# EAGLE design sidInterface (EAGLE 5.11)
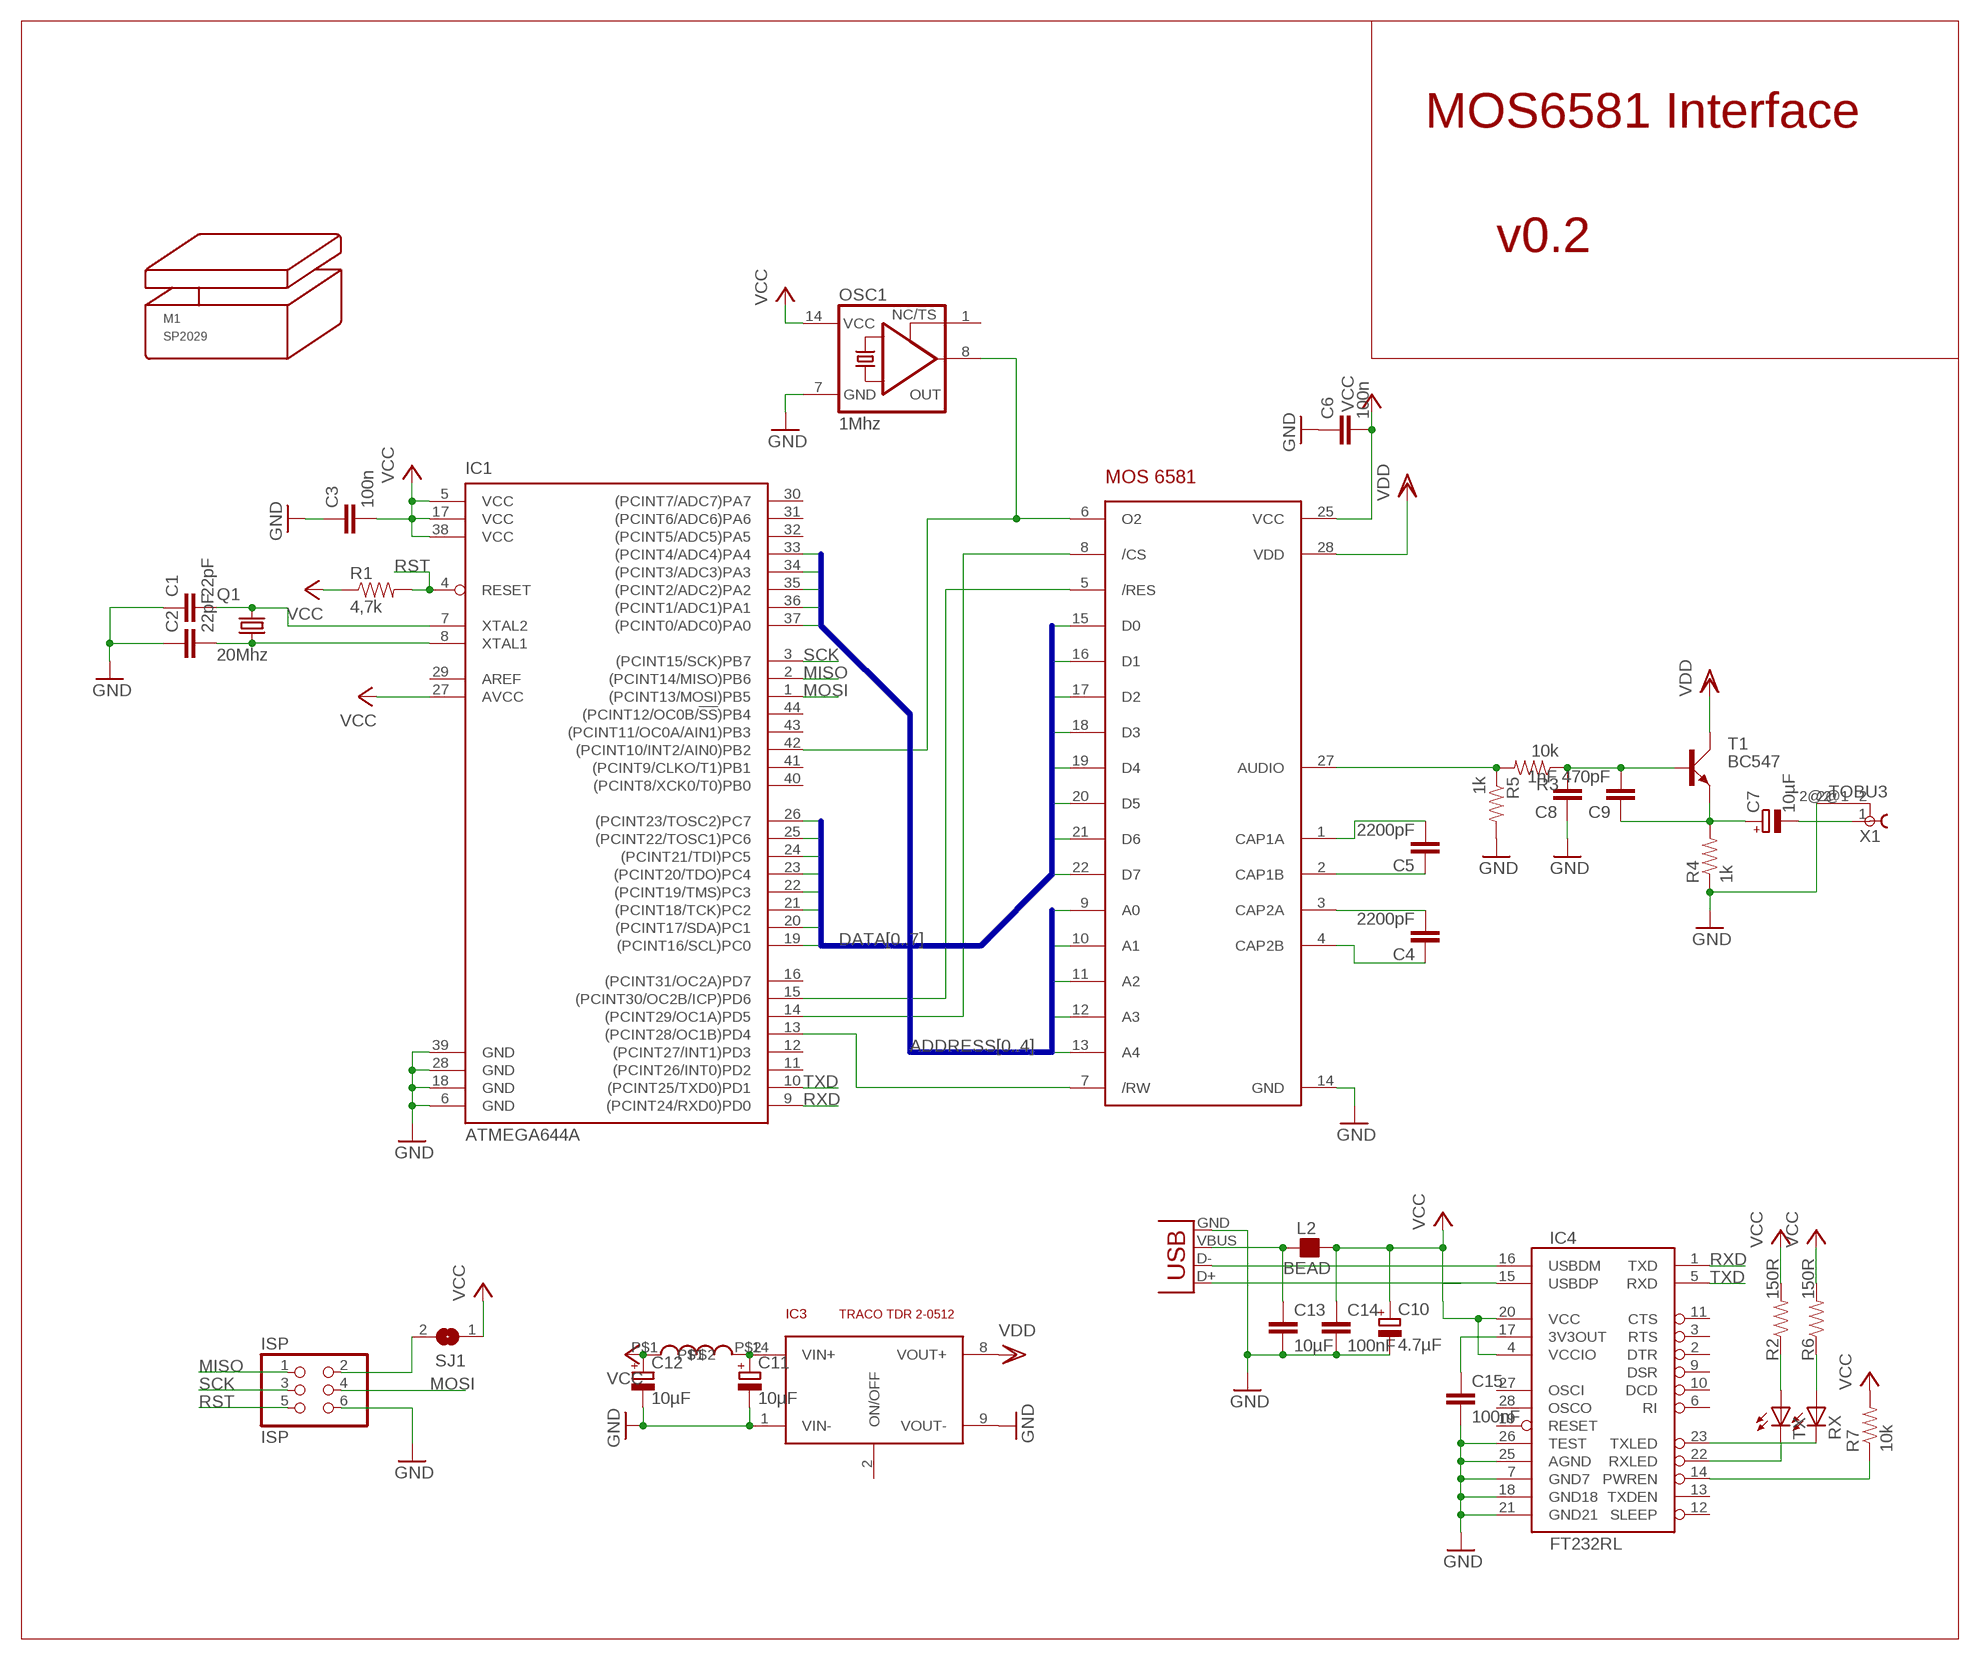
[diagram p0: schematic, sheet 1]

## Parts
C1  22pF  CAP0805  [0805]
C2  22pF  CAP0805  [0805]
C3  100n  CAP0805  [0805]
C4  2200pF  CAP0805  [0805]
C5  2200pF  CAP0805  [0805]
C6  100n  CAP0805  [0805]
C7  10µF  CPOL-EUSMCC  [SMC_C]
C8  1nF  CAP0805  [0805]
C9  470pF  CAP0805  [0805]
C10  4.7µF  CPOL-EUSMCC  [SMC_C]
C11  10µF  CPOL-EUSMCC  [SMC_C]
C12  10µF  CPOL-EUSMCC  [SMC_C]
C13  10µF  CAP0805  [0805]
C14  100nF  CAP0805  [0805]
C15  100nF  CAP0805  [0805]
IC1  ATMEGA644A  [TQFP44]
IC2  MOS6581  [DIL28]
IC3  TRACO TDR 2-0512  TRACO_TDR_2  [TRACO_TDR_2]
IC4  FT232RL  FT232RLSSOP  [SSOP28DB]
ISP  ISP  PINHD-2X03_2.54  [2X03]
L1  SMD-INDUCTOR-4012  [SMD4012]
L2  BEAD  FB_0805  [L0805]
M1  SP2029  [SP2029]
OSC1  1Mhz  XO-14  [DIL14S]
Q1  20Mhz  X22-OSCILLATOR  [X22]
R1  4,7k  RESISTOR  [0805]
R2  150R  RESISTOR  [0805]
R3  10k  RESISTOR  [0805]
R4  1k  RESISTOR  [0805]
R5  1k  RESISTOR  [0805]
R6  150R  RESISTOR  [0805]
R7  10k  RESISTOR  [0805]
RX  LEDCHIP-LED0805  [CHIP-LED0805]
SJ1  SJ  [SJ]
T1  BC547  [SOT54A]
TX  LEDCHIP-LED0805  [CHIP-LED0805]
X1  TOBU3  [TOBU3]
X2  USB-SMD-NS  [USB-MINIB-NOSTOP]

## Nets
ADDRESS0: IC1.37((PCINT0/ADC0)PA0) IC2.9(A0)
ADDRESS1: IC1.36((PCINT1/ADC1)PA1) IC2.10(A1)
ADDRESS2: IC1.35((PCINT2/ADC2)PA2) IC2.11(A2)
ADDRESS3: IC1.34((PCINT3/ADC3)PA3) IC2.12(A3)
ADDRESS4: IC1.33((PCINT4/ADC4)PA4) IC2.13(A4)
DATA0: IC1.19((PCINT16/SCL)PC0) IC2.15(D0)
DATA1: IC1.20((PCINT17/SDA)PC1) IC2.16(D1)
DATA2: IC1.21((PCINT18/TCK)PC2) IC2.17(D2)
DATA3: IC1.22((PCINT19/TMS)PC3) IC2.18(D3)
DATA4: IC1.23((PCINT20/TDO)PC4) IC2.19(D4)
DATA5: IC1.24((PCINT21/TDI)PC5) IC2.20(D5)
DATA6: IC1.25((PCINT22/TOSC1)PC6) IC2.21(D6)
DATA7: IC1.26((PCINT23/TOSC2)PC7) IC2.22(D7)
GND: C1.1 C2.1 C3.1 C6.1 C8.1 C10.- C11.- C12.- C13.2 C14.2 C15.2 IC1.6(GND) IC1.18(GND) IC1.28(GND) IC1.39(GND) IC2.14(GND) IC3.1(VIN-) IC3.9(VOUT-) IC4.7(GND7) IC4.18(GND18) IC4.21(GND21) IC4.25(AGND) IC4.26(TEST) ISP.6 OSC1.7(GND) R4.1 R5.2 X1.2@2 X2.GND
MISO: IC1.2((PCINT14/MISO)PB6) ISP.1
MOSI: IC1.1((PCINT13/MOSI)PB5) ISP.4
N$1: C2.2 IC1.8(XTAL1) Q1.1
N$2: C1.2 IC1.7(XTAL2) Q1.3
N$3: ISP.2 SJ1.2
N$4: C4.2 IC2.3(CAP2A)
N$5: C5.1 IC2.2(CAP1B)
N$6: C4.1 IC2.4(CAP2B)
N$7: C5.2 IC2.1(CAP1A)
N$8: IC1.13((PCINT28/OC1B)PD4) IC2.7(/RW)
N$9: IC1.15((PCINT30/OC2B/ICP)PD6) IC2.5(/RES)
N$10: IC1.14((PCINT29/OC1A)PD5) IC2.8(/CS)
N$11: IC1.42((PCINT10/INT2/AIN0)PB2) IC2.6(O2) OSC1.8(OUT)
N$14: IC2.27(AUDIO) R3.2 R5.1
N$15: C11.+ IC3.14(VIN+) L1.P$2
N$16: C8.2 C9.2 R3.1 T1.B
N$17: C7.+ C9.1 R4.2 T1.E
N$18: IC4.16(USBDM) X2.D-
N$19: C7.- X1.1
N$20: IC4.15(USBDP) X2.D+
N$21: R2.1 TX.A
N$22: R6.1 RX.A
N$23: C13.1 L2.1 X2.VBUS
N$24: IC4.14(PWREN) R7.1
N$27: IC4.22(RXLED) TX.C
N$28: IC4.23(TXLED) RX.C
N$29: C15.1 IC4.17(3V3OUT)
RST: IC1.4(RESET) ISP.5 R1.2
RXD: IC1.9((PCINT24/RXD0)PD0) IC4.1(TXD)
SCK: IC1.3((PCINT15/SCK)PB7) ISP.3
TXD: IC1.10((PCINT25/TXD0)PD1) IC4.5(RXD)
VCC: C3.2 C6.2 C10.+ C12.+ C14.1 IC1.5(VCC) IC1.17(VCC) IC1.27(AVCC) IC1.38(VCC) IC2.25(VCC) IC4.4(VCCIO) IC4.20(VCC) L1.P$1 L2.2 OSC1.14(VCC) R1.1 R2.2 R6.2 R7.2 SJ1.1
VDD: IC2.28(VDD) IC3.8(VOUT+) T1.C
Unconnected: IC1.11((PCINT26/INT0)PD2) IC1.12((PCINT27/INT1)PD3) IC1.16((PCINT31/OC2A)PD7) IC1.29(AREF) IC1.30((PCINT7/ADC7)PA7) IC1.31((PCINT6/ADC6)PA6) IC1.32((PCINT5/ADC5)PA5) IC1.40((PCINT8/XCK0/T0)PB0) IC1.41((PCINT9/CLKO/T1)PB1) IC1.43((PCINT11/OC0A/AIN1)PB3) IC1.44((PCINT12/OC0B/!SS!)PB4) IC3.2(ON/OFF) IC4.2(DTR) IC4.3(RTS) IC4.6(RI) IC4.9(DSR) IC4.10(DCD) IC4.11(CTS) IC4.12(SLEEP) IC4.13(TXDEN) IC4.19(RESET) IC4.27(OSCI) IC4.28(OSCO) OSC1.1(TS) X1.2 X1.2@1

## Buses
DATA[0..7]
ADDRESS[0..4]

## Notes on the sheet
- MOS6581 Interface
- v0.2
- TRACO TDR 2-0512

## Library data of the parts
C1-C6 C8 C9 C13-C15 = SparkFun:CAP: Capacitor Standard 0603 ceramic capacitor, and 0.1" leaded capacitor.
C7 C10-C12 = resistor:CPOL-EU: POLARIZED CAPACITOR, European symbol
IC1 = atmel:ATMEGA644: 8-bit Microcontroller with 64K Bytes In-System Programmable Flash Source: http://www.atmel.com/dyn/resources/prod_documents/doc2593.pdf; MPN: ATMEGA644PV-10AU; OC_FARNELL: 1455123; OC_NEWARK: 58M3748
IC2 = seb:MOS6581
IC3 = seb:TRACO_TDR_2
IC4 = SparkFun:FT232RL: USB UART FT232RL 4th Generation USB UART (USB <-> Serial) Controller. Spark Fun Electronics SKU : COM-00650
ISP = pinhead-2:PINHD-2X03: PIN HEADER
L1 = seb:SMD-INDUCTOR-4012
L2 = rc-master-smd:FB_: FERRITE BEAD
M1 = strapubox:SP2029: Gehäuse Strapubox Typ 2029 max. Bauteilhöhe, top-layer: 11,5 mm max. Bauteilhöhe, bottom-layer: 3,5 mm (Dicke der LP: 1,5 mm) Außenmaße: Länge: 80 mm Breite: 61 mm Höhe: 20,5 mm
OSC1 = crystal:XO-: CRYSTAL; OC_FARNELL: unknown; OC_NEWARK: unknown
Q1 = seb:X22-OSCILLATOR
R1-R7 = SparkFun:RESISTOR: Resistor Basic schematic elements and footprints for 0603, 1206, and PTH 1/10th watt (small) resistors.
RX TX = led:LED: LED OSRAM: - CHIPLED LG R971, LG N971, LY N971, LG Q971, LY Q971, LO R971, LY R971 LH N974, LH R974 LS Q976, LO Q976, LY Q976 LO Q996 - Hyper CHIPLED LW Q18S LB Q993, LB Q99A, LB R99A - SideLED LS A670, LO A670, LY A670, LG A670, LP A670 LB A673, LV A673, LT A673, LW A673 LH A674 LY A675 LS A676, LA A676, LO A676, LY A676, LW A676 LS A679, LY A679, LG A679 - Hyper Micro SIDELED® LS Y876, LA Y876, LO Y876, LY Y876 LT Y87S - SmartLED LW L88C, LW L88S LB L89C, LB L89S, LG L890 LS L89K, LO L89K, LY L89K LS L896, LA L896, LO L896, LY L896 - TOPLED LS T670, LO T670, LY T670, LG T670, LP T670 LSG T670, LSP T670, LSY T670, LOP T670, LYG T670 LG T671, LOG T671, LSG T671 LB T673, LV T673, LT T673, LW T673 LH T674 LS T676, LA T676, LO T676, LY T676, LB T676, LH T676, LSB T676, LW T676 LB T67C, LV T67C, LT T67C, LS T67K, LO T67K, LY T67K, LW E67C LS E67B, LA E67B, LO E67B, LY E67B, LB E67C, LV E67C, LT E67C LW T67C LS T679, LY T679, LG T679 LS T770, LO T770, LY T770, LG T770, LP T770 LB T773, LV T773, LT T773, LW T773 LH T774 LS E675, LA E675, LY E675, LS T675 LS T776, LA T776, LO T776, LY T776, LB T776 LHGB T686 LT T68C, LB T68C - Hyper Mini TOPLED® LB M676 - Mini TOPLED Santana® LG M470 LS M47K, LO M47K, LY M47K Source: http://www.osram.convergy.de LUXEON: - LUMILED® LXK2-PW12-R00, LXK2-PW12-S00, LXK2-PW14-U00, LXK2-PW14-V00 LXK2-PM12-R00, LXK2-PM12-S00, LXK2-PM14-U00 LXK2-PE12-Q00, LXK2-PE12-R00, LXK2-PE12-S00, LXK2-PE14-T00, LXK2-PE14-U00 LXK2-PB12-K00, LXK2-PB12-L00, LXK2-PB12-M00, LXK2-PB14-N00, LXK2-PB14-P00, LXK2-PB14-Q00 LXK2-PR12-L00, LXK2-PR12-M00, LXK2-PR14-Q00, LXK2-PR14-R00 LXK2-PD12-Q00, LXK2-PD12-R00, LXK2-PD12-S00 LXK2-PH12-R00, LXK2-PH12-S00 LXK2-PL12-P00, LXK2-PL12-Q00, LXK2-PL12-R00 Source: www.luxeon.com KINGBRIGHT: KA-3528ASYC Source: www.kingbright.com
SJ1 = jumper:SJ: SMD solder JUMPER
T1 = transistor-small-signal:BC547: NPN TRANSISTOR
X1 = con-hirschmann:TOBU3: Female Cinch CONNECTOR ( RCA Jack ); MF: FARNELL; MPN: TOBU 3; OC_FARNELL: 592791; OC_NEWARK: 06WX5914
X2 = SparkFun:USB: USB Connectors USB-B-PTH is fully proven SKU : PRT-00139 USB-miniB is fully proven SKU : PRT-00587 USB-A-PCB is untested. USB-A-H is throughly reviewed, but untested. Spark Fun Electronics SKU : PRT-00437 USB-B-SMT is throughly reviewed, but untested. Needs silkscreen touching up. USB-A-S has not been used/tested USB-MB-H has not been used/tested

## Board
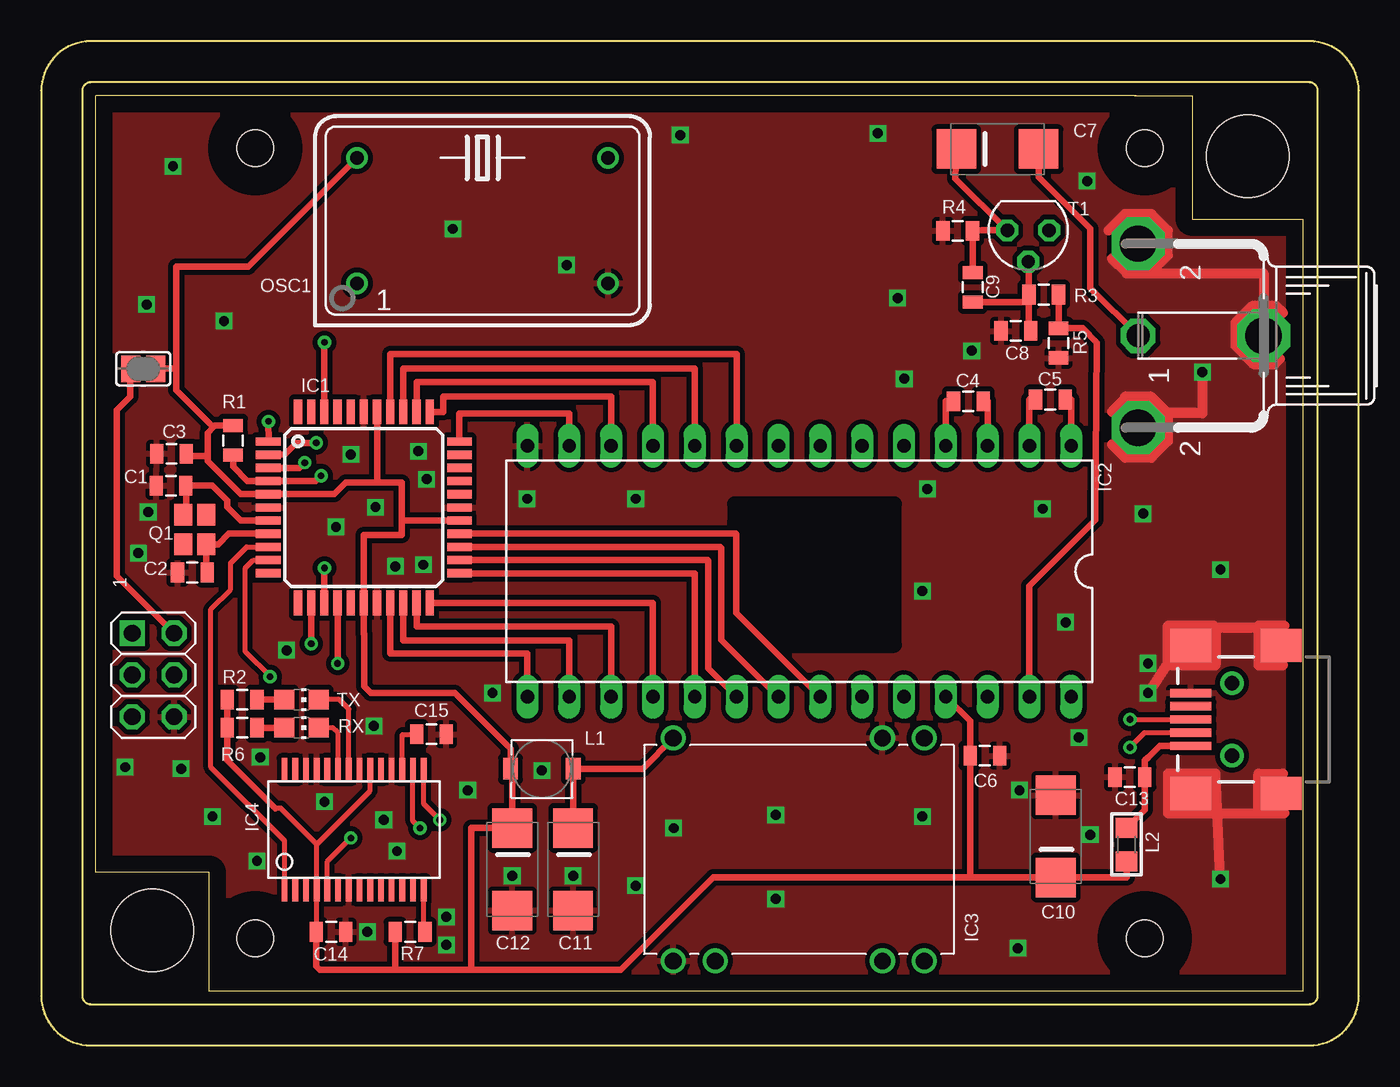
[diagram p1: board, top side]
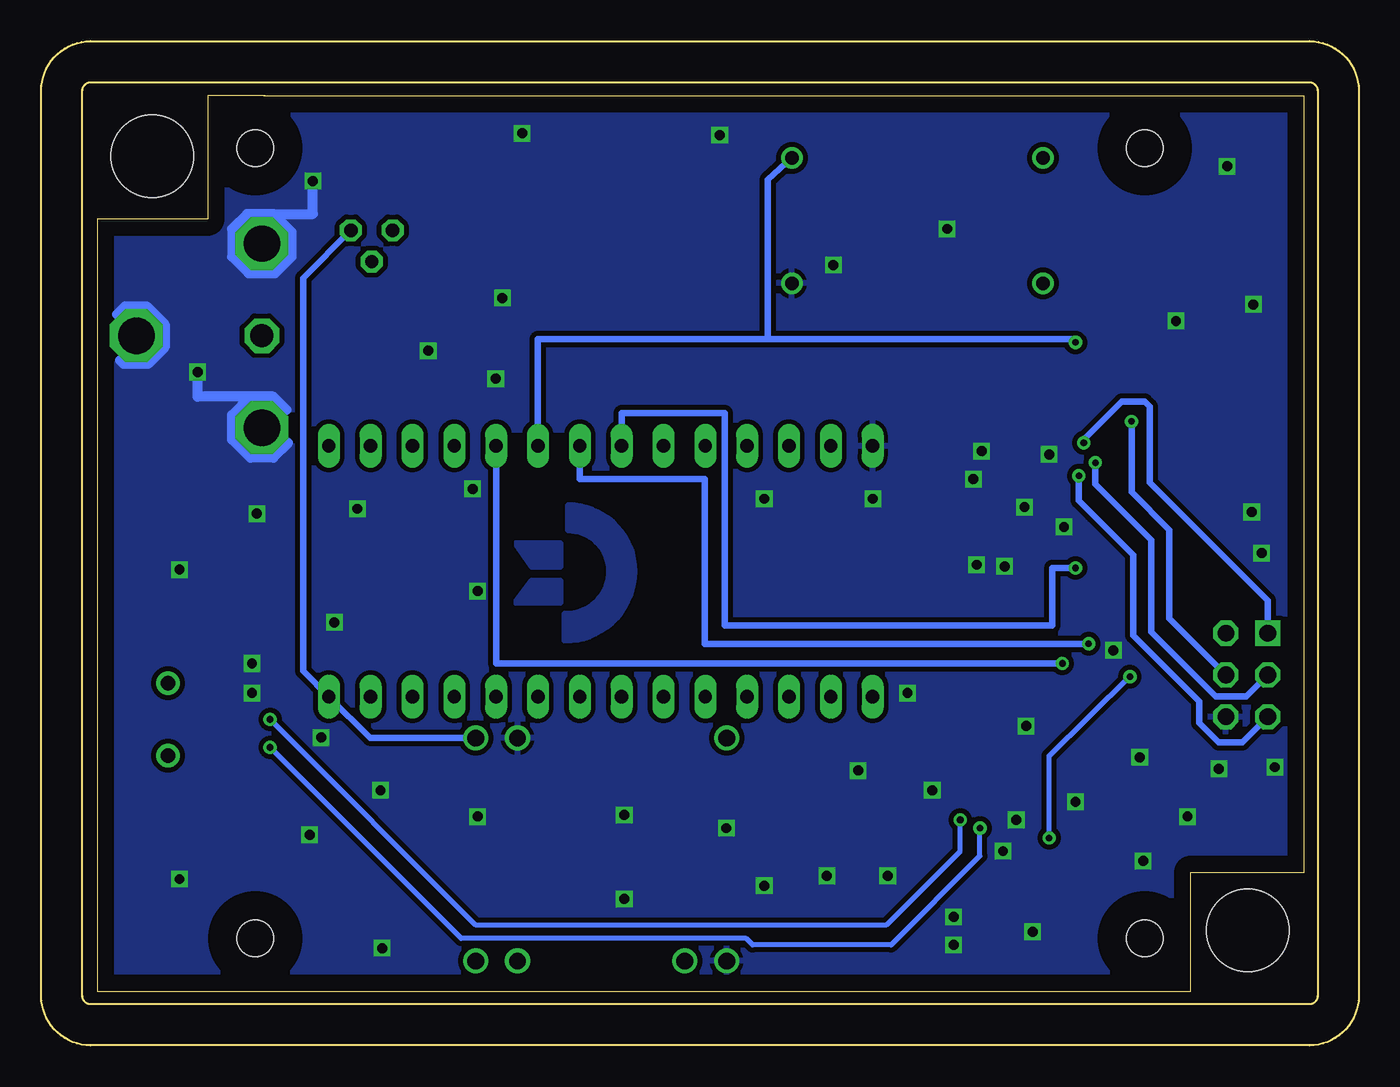
[diagram p2: board, bottom side, seen from below]

Size 73.3 x 54.4 mm. Coordinates in mm from the lower left corner, seen from the top.
Outline: 63.2,54.4 63.1,54.4
Outline: 63.1,54.4 0,54.4 0,7.2 6.9,7.2 6.9,0 73.3,0 73.3,46.9 66.6,46.9 66.6,54.4 63.1,54.4
Copper layers (1*16): Top 0.035mm / dielectric 1.5mm / Bottom 0.035mm
Design rules "default *": minimum track width 10mil, minimum drill 0.4mm, track to track 8mil, track to pad 8mil, pad to pad 8mil, via to via 8mil, smd to smd 8mil, copper to edge 40mil, drill to drill 8mil, minimum pad ring 10mil, minimum via ring 8mil, stop-mask expansion 4mil, vias tented up to drill 24mil, thermal gap 10mil
tRestrict: 5 lines
bRestrict: 2 lines

### Footprints (pad centres in the part's own frame; a part is rotated, then mirrored left to right if it is on the bottom)
0805 = smd 0.8 x 1.2: 1 -0.9,0; 2 0.9,0
SMC_C = smd 2.4 x 2.4: + -2.5,0; - 2.5,0
TQFP44 = smd 1.5 x 0.5: 1 -5.8,4; 2 -5.8,3.2; 3 -5.8,2.4; 4 -5.8,1.6; 5 -5.8,0.8; 6 -5.8,0; 7 -5.8,-0.8; 8 -5.8,-1.6; 9 -5.8,-2.4; 10 -5.8,-3.2; 11 -5.8,-4; 23 5.8,-4; 24 5.8,-3.2; 25 5.8,-2.4; 26 5.8,-1.6; 27 5.8,-0.8; 28 5.8,0; 29 5.8,0.8; 30 5.8,1.6; 31 5.8,2.4; 32 5.8,3.2; 33 5.8,4 | smd 0.5 x 1.5: 12 -4,-5.8; 13 -3.2,-5.8; 14 -2.4,-5.8; 15 -1.6,-5.8; 16 -0.8,-5.8; 17 0,-5.8; 18 0.8,-5.8; 19 1.6,-5.8; 20 2.4,-5.8; 21 3.2,-5.8; 22 4,-5.8; 34 4,5.8; 35 3.2,5.8; 36 2.4,5.8; 37 1.6,5.8; 38 0.8,5.8; 39 0,5.8; 40 -0.8,5.8; 41 -1.6,5.8; 42 -2.4,5.8; 43 -3.2,5.8; 44 -4,5.8
DIL28 = drill 0.813 long: 1 -16.51,-7.62; 2 -13.97,-7.62; 3 -11.43,-7.62; 4 -8.89,-7.62; 5 -6.35,-7.62; 6 -3.81,-7.62; 7 -1.27,-7.62; 8 1.27,-7.62; 9 3.81,-7.62; 10 6.35,-7.62; 11 8.89,-7.62; 12 11.43,-7.62; 13 13.97,-7.62; 14 16.51,-7.62; 15 16.51,7.62; 16 13.97,7.62; 17 11.43,7.62; 18 8.89,7.62; 19 6.35,7.62; 20 3.81,7.62; 21 1.27,7.62; 22 -1.27,7.62; 23 -3.81,7.62; 24 -6.35,7.62; 25 -8.89,7.62; 26 -11.43,7.62; 27 -13.97,7.62; 28 -16.51,7.62
TRACO_TDR_2 = drill 1.016 round: 1 6.769,-7.62; 2 6.769,-5.08; 6 6.769,5.08; 7 6.769,7.62; 8 -6.769,7.62; 9 -6.769,5.08; 14 -6.769,-7.62
SSOP28DB = smd 0.348 x 1.397: 1 -4.225,-3.656; 2 -3.575,-3.656; 3 -2.925,-3.656; 4 -2.275,-3.656; 5 -1.625,-3.656; 6 -0.975,-3.656; 7 -0.325,-3.656; 8 0.325,-3.656; 9 0.975,-3.656; 10 1.625,-3.656; 11 2.275,-3.656; 12 2.925,-3.656; 13 3.575,-3.656; 14 4.225,-3.656; 15 4.225,3.656; 16 3.575,3.656; 17 2.925,3.656; 18 2.275,3.656; 19 1.625,3.656; 20 0.975,3.656; 21 0.325,3.656; 22 -0.325,3.656; 23 -0.975,3.656; 24 -1.625,3.656; 25 -2.275,3.656; 26 -2.925,3.656; 27 -3.575,3.656; 28 -4.225,3.656
2X03 = drill 1.016 square: 1 -2.54,-1.27 | drill 1.016 octagon: 2 -2.54,1.27; 3 0,-1.27; 4 0,1.27; 5 2.54,-1.27; 6 2.54,1.27
SMD4012 = smd 0.9 x 1.3: P$1 -1.9,0; P$2 1.9,0
L0805 = smd 1.2 x 1.3: 1 -1.016,0; 2 1.016,0
SP2029 = hole 2.2: -27,-24; -27,24; 27,24; 27,-24 | hole 5: 33.25,23.5; -33.25,-23.5
DIL14S = drill 0.813 round: 1 -7.62,-3.81; 7 7.62,-3.81; 8 7.62,3.81; 14 -7.62,3.81
X22 = smd 1.3 x 1.1: 1 0.9,0.7; 2 -0.9,0.7; 3 -0.9,-0.7; 4 0.9,-0.7
CHIP-LED0805 = smd 1.2 x 1.2: A 0,-1.05; C 0,1.05
SJ = smd 1.168 x 1.6: 1 -0.762,0; 2 0.762,0
SOT54A = drill 0.813 octagon: B 0,1.905; C -1.27,0; E 1.27,0
TOBU3 = drill 1.397 octagon: 1 0,-2.54 | drill 2.21 octagon: 2 5.588,-2.54; 2@1 -5.588,-2.54; 2@2 0,5.08
USB-MINIB-NOSTOP = smd 2.5 x 0.5: D+ 2.5,0; D- 2.5,0.8; GND 2.5,-1.6; ID 2.5,-0.8; VBUS 2.5,1.6 | smd 2.5 x 2: G1 -3,-4.5; G2 -3,4.5; G3 2.5,4.5; G4 2.5,-4.5 | drill 0.9 pad 0.8 round: H1 0,2.2 | drill 0.9 pad 0.787 round: H2 0,-2.2

### Placement (x,y rotation side)
C1  4.58,30.7 0 top
C2  5.88,25.42 0 top
C3  4.61,32.64 0 top
C4  52.99,35.83 0 top
C5  57.97,35.93 0 top
C6  54,14.3 180 top
C7  54.76,51.14 0 top
C8  55.88,40.1 0 top
C9  53.26,42.75 270 top
C10  58.3,9.4 90 top
C11  29,7.4 270 top
C12  25.3,7.4 270 top
C13  62.8,13 180 top
C14  14.3,3.6 0 top
C15  20.4,15.6 0 top
IC1  16.29,29.38 0 top
IC2  42.73,25.5 180 top
IC3  42.7,8.6 270 top
IC4  15.7,9.8 0 top
ISP  3.5,19.2 270 top
L1  27.1,13.5 0 top
L2  62.6,8.9 270 top
M1  36.7,27.2 0 top
OSC1  23.5,46.8 0 top
Q1  6.03,28.04 270 top
R1  8.35,33.45 270 top
R2  8.9,17.7 180 top
R3  57.57,42.3 0 top
R4  52.35,46.18 0 top
R5  58.47,39.36 270 top
R6  8.9,16 180 top
R7  19.1,3.6 180 top
RX  12.5,16 270 top
SJ1  2.9,37.8 180 top
T1  56.63,46.21 180 top
TX  12.5,17.7 270 top
X1  65.84,39.81 270 top
X2  69,16.5 180 top

### Tracks (layer width: path | path; a pad name or v marks a point on that pad's centre or on a via)
ADDRESS0
  Top 0.406: IC2.9 38.92,38.7 17.89,38.7 IC1.37
ADDRESS1
  Top 0.406: IC1.36 18.69,37.8 36.38,37.8 IC2.10
ADDRESS2
  Top 0.406: IC2.11 33.84,37 19.49,37 IC1.35
ADDRESS3
  Top 0.406: IC1.34 21.1,35.18 21.1,36.1 31.3,36.1 IC2.12
ADDRESS4
  Top 0.406: IC2.13 28.76,35.08 22.09,35.08 IC1.33
C64
  pour Bottom: 44.7,29.5 arc90 40.7,25.5 arc90 44.9,21.3 44.9,22.9 44.8,22.9 arc-90 42.2,25.5 arc-90 44.7,28 44.7,29.4 arc90
  pour Bottom: 45.2,23.6 47.9,23.6 46.9,24.9 45.2,24.9
  pour Bottom: 45.2,27.2 47.9,27.2 46.9,25.8 45.2,25.8
DATA0
  Top 0.406: IC1.19 17.89,20.52 26.22,20.52 IC2.15
DATA1
  Top 0.406: IC1.20 18.69,21.29 28.76,21.29 IC2.16
DATA2
  Top 0.406: IC1.21 19.49,22.16 31.3,22.16 IC2.17
DATA3
  Top 0.406: IC1.22 33.84,23.58 IC2.18
DATA4
  Top 0.406: IC1.23 36.38,25.38 IC2.19
DATA5
  Top 0.406: IC2.20 37.2,19.6 37.2,26.1 37.18,26.18 IC1.24
DATA6
  Top 0.406: IC2.21 38,21.34 38,26.9 37.92,26.98 IC1.25
DATA7
  Top 0.406: IC2.22 38.9,22.98 38.9,27.7 38.88,27.78 IC1.26
GND  (via drill 0.6)
  Top 0.305: IC4.7 15.38,6.02 | 17.97,13.52 17.97,13.54 | 17.97,13.52 IC4.18 17.97,13.52 | IC4.25 13.43,13.12 | IC4.26 12.77,13.33 | IC4.21 16.02,13.62
  Top 0.61: 65.1,35.1 64.1,36.1 62.5,36.1 62.5,36 61.7,35.2 | 65.1,35.1 65.1,33.4 64.1,32.4 62.5,32.4 61.7,33.2 | 71.9,38.4 71.6,38.1 70.3,38.1 69.2,39.2 69.2,40.6 70.2,41.6 71.7,41.6 72.1,41.2 70.92,41.2 X1.2@2 70.92,43.6 62.6,43.6 | 65.1,35.1 67.2,35.1 v67.2,37.6 | 61.5,46.2 62.5,47.2 64.1,47.2 65.1,46.2 65.1,44.7 64,43.6 62.6,43.6 | 62.6,43.6 61.7,44.5 | 65.1,19.8 67.9,19.8 | 65.1,19.9 65.1,19.8 | 65.1,19.9 65.1,22.2 67.9,22.2 68,22.1 | 68,22.1 68,19.8 | 72.1,19.8 70.6,19.8 70.6,22.2 | 70.6,22.2 72.2,22.2 | 72.1,13.2 70.6,13.2 70.6,10.8 | 70.6,10.8 72.2,10.8 | 68,10.8 65.1,10.8 65.1,13.2 68,13.2 v68.3,6.8 | 68,10.8 68,12.8 | v63.9,18.1 65.1,19.9 | 65.1,19.9 65.1,19.8 | 68,22.1 70.6,22.1 70.6,22.2 | 68,10.8 70.6,10.8
  Bottom 0.61: 61.5,44.6 62.5,43.6 64.1,43.6 65.1,44.6 65.1,46.3 64.2,47.2 62.6,47.2 | 62.6,47.2 61.5,46.1 61.5,44.7 | 71.9,38.3 71.7,38.1 70.2,38.1 69.2,39.1 69.2,40.5 70.3,41.6 71.6,41.6 72.1,41.1 70.92,41.1 X1.2@2 | 62.6,47.2 60.2,47.2 v60.2,49.2 | 62.6,36.1 61.8,35.3 | 62.6,36.1 64,36.1 65.1,35 65.1,33.5 64,32.4 62.6,32.4 61.7,33.3 | 62.6,36.1 67.2,36.1 v67.2,37.6
  other vias: 14.6,28.2 25.3,7 17,29.4 19.9,25.9 19.6,32.8 3.1,41.7 3.2,29.1 47.5,52.1 53.2,38.9 15.5,32.6 20.1,31.1 18.2,25.8 24.1,18.1 2.6,26.6 7.1,10.6 29,7 1.8,13.6 5.2,13.5 22.6,12.2 58.9,22.4 57.5,29.3 50.5,30.5 50.2,24.3 18.3,8.5 17.5,10.4 21.3,2.8 16.5,3.6 10,14.2 13.9,11.5 9.8,7.9 16.9,16.1 7.8,40.7 28.6,44.1 35.5,52 63.9,19.9 59.7,15.4 60.4,9.5 56.1,12.2 41.3,5.6 35.1,9.9 27.1,13.4 56,2.6 21.3,4.5 49.1,37.2 63.6,29 21.7,46.3 4.7,50.1 32.8,6.4 41.3,10.7 50.2,10.6 68.3,25.6 48.7,42.1 11.6,20.7 32.8,29.9 26.2,29.9
  pour Top (isolate 0.3): 0,54.3 74,54.3 73.3,0 0,0.1
  pour Bottom (isolate 0.3): 0,54.3 73.8,54.3 73.4,0.1 0,0.2
MISO  (via drill 0.4)
  Top 0.406: v13.4,33.3 12.2,33.3 11.48,32.58 IC1.2
  Bottom 0.406: ISP.1 2.23,23.73 9.4,30.9 9.4,35.5 9.7,35.8 11.1,35.8 13.4,33.5 v13.4,33.3
MOSI  (via drill 0.4)
  Top 0.406: v10.5,34.6 10.51,33.4 IC1.1
  Bottom 0.406: ISP.4 8.2,22.63 8.2,28 10.5,30.3 v10.5,34.6
N$1
  Top 0.406: C2.2 6.73,25.27 Q1.1 7.44,27.14 8.08,27.78 IC1.8
N$2
  Top 0.406: Q1.3 5.53,28.95 C1.2 7.1,30.7 8,29.8 8,29.4 8.82,28.58 IC1.7
N$3
  Top 0.406: SJ1.2 2.1,37.76 2.1,36.1 1.3,35.3 1.3,25.2 3.77,22.73 ISP.2
N$4
  Top 0.406: IC2.3 54.16,35.83 C4.2
N$5
  Top 0.406: IC2.2 56.7,35.93 C5.1
N$6
  Top 0.406: IC2.4 51.62,35.83 C4.1
N$7
  Top 0.406: IC2.1 59.24,35.93 C5.2
N$8  (via drill 0.4)
  Top 0.406: v13.1,21.1 IC1.13
  Bottom 0.406: IC2.7 44,31.1 36.4,31.1 36.4,21.1 v13.1,21.1
N$9  (via drill 0.4)
  Top 0.406: v14.7,19.9 IC1.15
  Bottom 0.406: IC2.5 49.08,19.9 v14.7,19.9
N$10  (via drill 0.4)
  Top 0.406: v13.9,25.7 IC1.14
  Bottom 0.406: IC2.8 41.46,35.1 35.2,35.1 35.2,22.2 15.3,22.2 15.3,25.7 v13.9,25.7
N$11  (via drill 0.4)
  Top 0.406: v13.9,39.4 IC1.42
  Bottom 0.406: IC2.6 46.54,39.6 32.6,39.6 | 32.6,39.6 26.4,39.6 13.9,39.6 v13.9,39.4 | OSC1.8 32.6,49.29 32.6,39.6
N$14
  Top 0.406: R3.2 R5.1 59.94,40.26 60.8,39.4 60.7,28.6 56.7,24.6 IC2.27
N$15
  Top 0.406: IC3.14 33.21,13.5 30.6,13.5 L1.P$2 C11.+
N$16
  Top 0.406: T1.B 56.67,44.31 R3.1 56.67,41.85 | 56.67,41.85 56.67,40.1 C8.2 | C9.2 56.67,41.85
N$17
  Top 0.406: C9.1 R4.2 53.85,46.21 T1.E 52.21,49.36 C7.+
N$18  (via drill 0.4)
  Top 0.305: IC4.16 19.27,10.33 v19.7,9.9 | v62.8,14.8 63.7,15.7 X2.D-
  Bottom 0.305: v19.7,9.9 19.7,8.2 25.1,2.8 33.5,2.8 33.9,3.2 51.2,3.2 v62.8,14.8
N$19
  Top 0.406: X1.1 60.4,42.71 60.4,46.3 57.26,49.44 C7.-
N$20  (via drill 0.4)
  Top 0.305: IC4.15 19.93,11.38 v20.9,10.4 | v62.8,16.5 X2.D+
  Bottom 0.305: v20.9,10.4 20.9,8.5 25.4,4 50.3,4 v62.8,16.5
N$21
  Top 0.406: R2.1 TX.A
N$22
  Top 0.406: R6.1 RX.A
N$23
  Top 0.406: X2.VBUS 64.6,14.9 63.9,14.2 63.7,14 C13.1 63.7,11.02 L2.1
N$24
  Top 0.305: IC4.14 19.93,3.6 R7.1
N$27
  Top 0.305: IC4.22 15.38,17.12 15,17.5 14.8,17.7 TX.C
N$28
  Top 0.305: IC4.23 14.72,15.58 14.7,15.7 14.4,16 RX.C
N$29
  Top 0.305: IC4.17 18.62,15.58 C15.1
RST  (via drill 0.4)
  Top 0.406: R1.2 8.35,31.85 9.22,30.98 IC1.4 13.38,30.98 v13.7,31.3
  Bottom 0.406: ISP.5 3.79,15.1 5.2,15.1 6.4,16.3 6.4,17.6 10.4,21.6 10.4,23.7 10.4,26.5 12.9,29 | 12.9,29 13.7,29.8 v13.7,31.3 | 12.9,29 12.8,28.9
RXD
  Top 0.305: IC4.1 11.47,9.12 7,13.6 7,23.2 8.2,24.4 8.2,26 8.9,26.7 9.18,26.98 IC1.9
SCK  (via drill 0.4)
  Top 0.406: v12.7,32.1 12.38,31.78 IC1.3
  Bottom 0.406: ISP.3 3.53,17.9 5.4,17.9 9.3,21.8 9.3,27.4 12.7,30.8 12.7,31.6 v12.7,32.1
TXD  (via drill 0.4)
  Top 0.305: IC4.5 14.07,7.88 v15.5,9.3 | v10.6,19.1 9.1,20.6 9.1,25.7 9.4,26 9.58,26.18 IC1.10
  Bottom 0.305: v15.5,9.3 15.5,14.3 v10.6,19.1
VCC
  Top 0.305: IC4.20 16.68,12.17 13.43,8.92 | 10.9,11.1 11.25,11.1 13.43,8.92 | C14.1 13.43,4.12 IC4.4 13.43,8.92
  Top 0.406: 18.6,28.58 IC1.27 | 18.6,28.58 18.6,27.7 16.29,27.7 IC1.17 16.29,21.7 16.3,21.7 16.3,18.5 16.7,18.1 21.8,18.1 25.2,14.7 L1.P$1 25.3,13.4 C12.+ 22.8,9.9 22.8,1.3 | 17.09,30.9 18.6,30.9 18.6,28.58 | 17.09,30.9 IC1.38 | 6.8,32.5 6.8,32.2 8.82,30.18 IC1.5 14.48,30.18 15.2,30.9 17.09,30.9 | 6.8,32.5 6.8,33.9 7.15,34.25 | 7.15,34.25 7.25,34.35 R1.1 | C3.2 5.51,32.5 6.8,32.5 | 4.9,37.8 4.9,36.5 7.15,34.25 | 4.9,37.8 4.9,44 9.27,44 OSC1.14 | 4.9,37.8 SJ1.1 | 10.9,11.1 8,14 R6.2 R2.2 | C14.1 13.4,1.5 13.6,1.3 18.2,1.3 | 18.2,1.3 22.8,1.3 | 18.2,1.3 R7.2 | L2.2 62.6,6.9 C10.+ 53.1,6.9 | 53.1,6.9 C6.2 53.1,16.4 IC2.25 | 22.8,1.3 31.9,1.3 37.5,6.9 53.1,6.9
VDD
  Bottom 0.406: T1.C 60.8,43.31 60.8,19.44 IC2.28 56.73,15.37 IC3.8

### Text on the board
tPlace: 1
tNames: Q1
tStop: seb@exse.net | SID Module | v0.2 | <<</>>
bStop: seb@exse.net | SID Module | v0.2 | <<</>>